# EAGLE design PCB-BI8-3x1 (EAGLE 7.1.0)

## Sheet 1 of 2
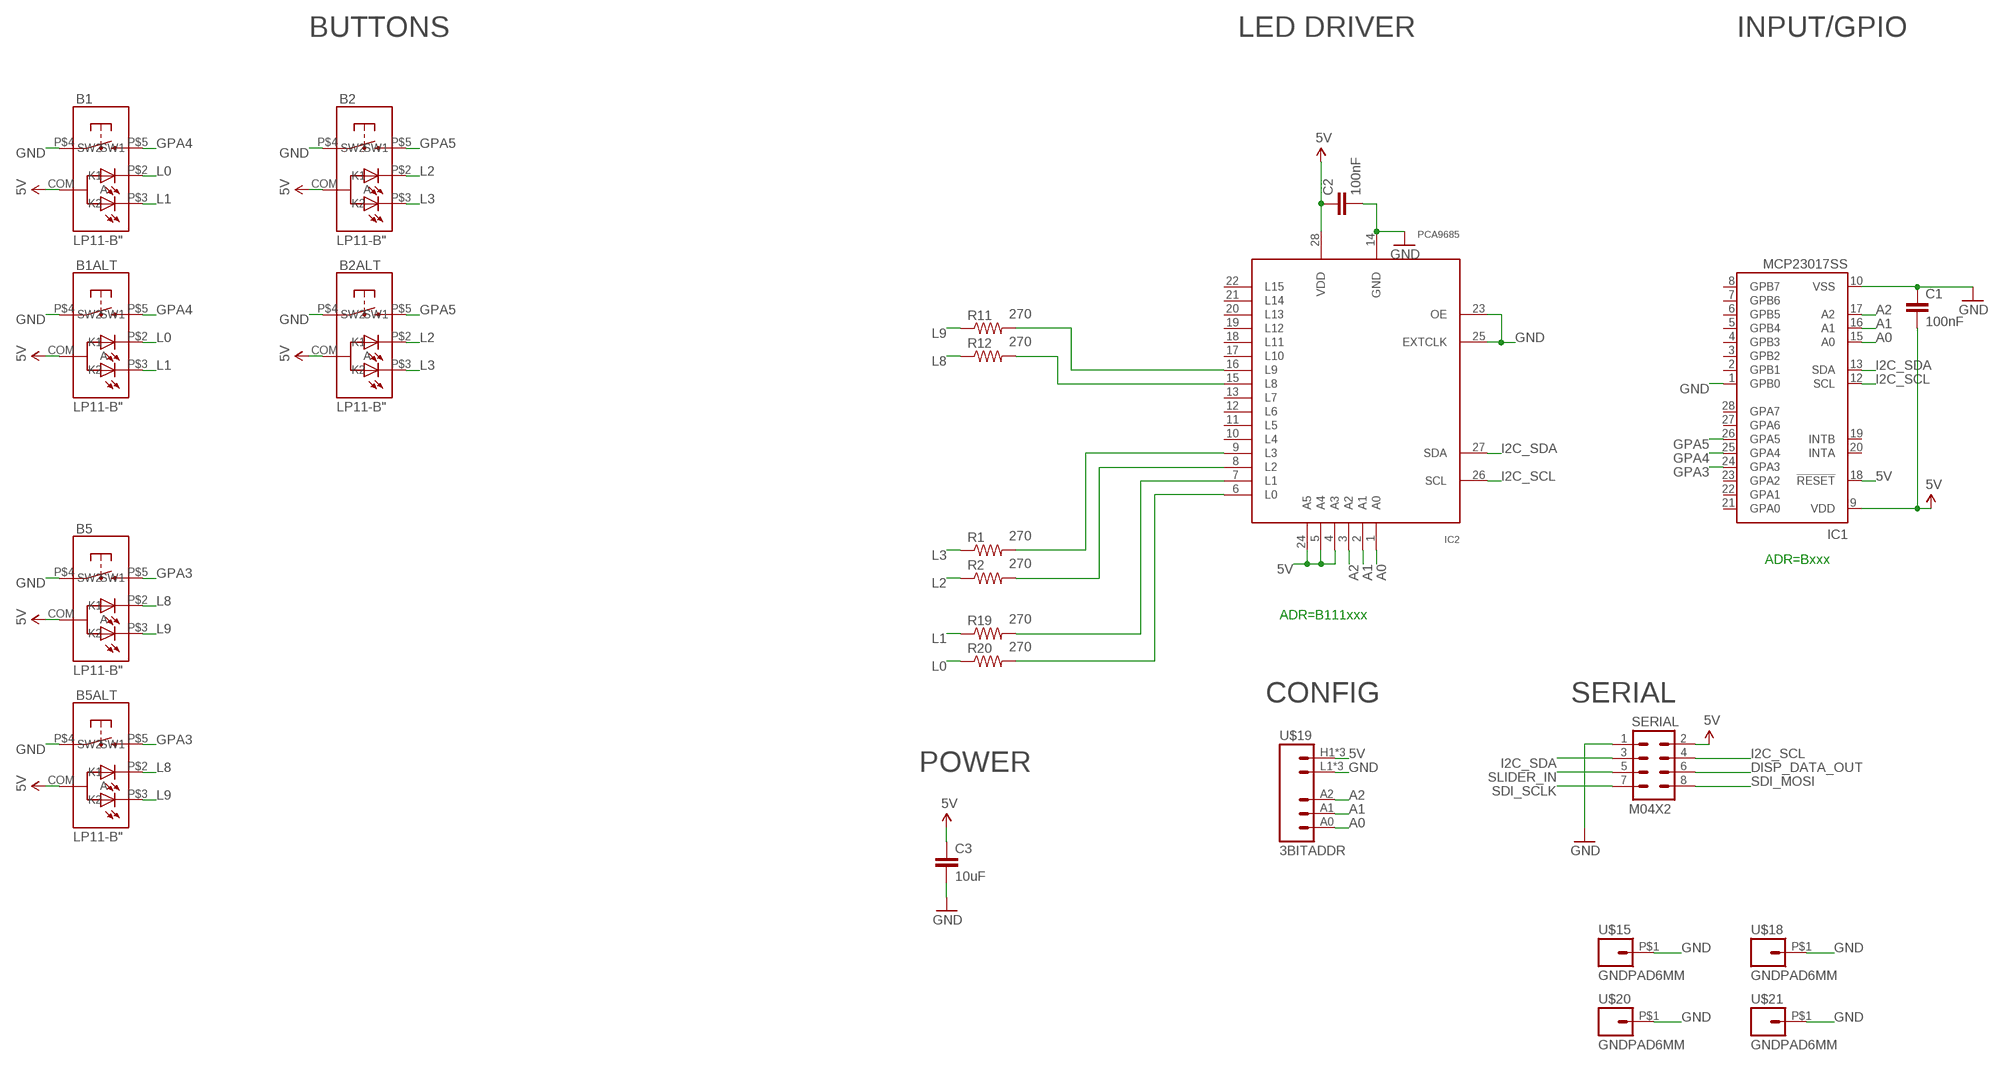
[diagram p0: schematic, sheet 1]

### Parts
B1  LP11-B"  [LP11]
B1ALT  LP11-B"  [LP11]
B2  LP11-B"  [LP11]
B2ALT  LP11-B"  [LP11]
B5  LP11-B"  [LP11]
B5ALT  LP11-B"  [LP11]
C1  100nF  CAP0603-CAP  [0603-CAP]
C2  100nF  CAP0603-CAP  [0603-CAP]
C3  10uF  CAP0805  [0805]
IC1  MCP23017SS  [SSOP28]
IC2  PCA9685  [TSSOP28]
R1  270  RESISTOR0603-RES  [0603-RES]
R2  270  RESISTOR0603-RES  [0603-RES]
R11  270  RESISTOR0603-RES  [0603-RES]
R12  270  RESISTOR0603-RES  [0603-RES]
R19  270  RESISTOR0603-RES  [0603-RES]
R20  270  RESISTOR0603-RES  [0603-RES]
SERIAL  M04X2  [2X4]
U$15  GNDPAD6MM  [3.2MMPAD6MM]
U$18  GNDPAD6MM  [3.2MMPAD6MM]
U$19  3BITADDR  [3BITADDR]
U$20  GNDPAD6MM  [3.2MMPAD6MM]
U$21  GNDPAD6MM  [3.2MMPAD6MM]

### Nets
5V [Power]: B1.COM(A) B1ALT.COM(A) B2.COM(A) B2ALT.COM(A) B5.COM(A) B5ALT.COM(A) C1.2 C2.1 C3.1 IC1.9(VDD) IC1.18(!RESET) IC2.4(A3) IC2.5(A4) IC2.24(A5) IC2.28(VDD) SERIAL.2 U$19.H1(VCC) U$19.H2(VCC) U$19.H3(VCC)
A0: IC1.15(A0) IC2.1(A0) U$19.A0
A1: IC1.16(A1) IC2.2(A1) U$19.A1
A2: IC1.17(A2) IC2.3(A2) U$19.A2
DISP_DATA_OUT: SERIAL.6
GND [Power]: B1.P$4(SW1) B1ALT.P$4(SW1) B2.P$4(SW1) B2ALT.P$4(SW1) B5.P$4(SW1) B5ALT.P$4(SW1) C1.1 C2.2 C3.2 IC1.1(GPB0) IC1.10(VSS) IC2.14(GND) IC2.23(OE) IC2.25(EXTCLK) SERIAL.1 U$15.P$1 U$18.P$1 U$19.L1(GND) U$19.L2(GND) U$19.L3(GND) U$20.P$1 U$21.P$1
GPA3: B5.P$5(SW2) B5ALT.P$5(SW2) IC1.24(GPA3)
GPA4: B1.P$5(SW2) B1ALT.P$5(SW2) IC1.25(GPA4)
GPA5: B2.P$5(SW2) B2ALT.P$5(SW2) IC1.26(GPA5)
I2C_SCL: IC1.12(SCL) IC2.26(SCL) SERIAL.4
I2C_SDA: IC1.13(SDA) IC2.27(SDA) SERIAL.3
L0: B1.P$2(K1) B1ALT.P$2(K1) R20.1
L1: B1.P$3(K2) B1ALT.P$3(K2) R19.1
L2: B2.P$2(K1) B2ALT.P$2(K1) R2.1
L3: B2.P$3(K2) B2ALT.P$3(K2) R1.1
L8: B5.P$2(K1) B5ALT.P$2(K1) R12.1
L9: B5.P$3(K2) B5ALT.P$3(K2) R11.1
N$1: IC2.8(L2) R2.2
N$2: IC2.9(L3) R1.2
N$12: IC2.7(L1) R19.2
N$19: IC2.6(L0) R20.2
N$20: IC2.15(L8) R12.2
N$21: IC2.16(L9) R11.2
SDI_MOSI: SERIAL.8
SDI_SCLK: SERIAL.7
SLIDER_IN: SERIAL.5
Unconnected: IC1.2(GPB1) IC1.3(GPB2) IC1.4(GPB3) IC1.5(GPB4) IC1.6(GPB5) IC1.7(GPB6) IC1.8(GPB7) IC1.19(INTB) IC1.20(INTA) IC1.21(GPA0) IC1.22(GPA1) IC1.23(GPA2) IC1.27(GPA6) IC1.28(GPA7) IC2.10(L4) IC2.11(L5) IC2.12(L6) IC2.13(L7) IC2.17(L10) IC2.18(L11) IC2.19(L12) IC2.20(L13) IC2.21(L14) IC2.22(L15)

### Notes on the sheet
- BUTTONS | LED DRIVER | INPUT/GPIO
- ADR=Bxxx
- ADR=B111xxx
- CONFIG | SERIAL
- POWER

## Sheet 2 of 2

## Library data of the parts
B1 B1ALT B2 B2ALT B5 B5ALT = SKAARHOJ:LP11-B
C1-C3 = SparkFun:CAP: Capacitor Standard 0603 ceramic capacitor, and 0.1" leaded capacitor.
IC1 = microchip:MCP23017: http://ww1.microchip.com/downloads/en/DeviceDoc/21952a.pdf Source: http://ww1.microchip.com/downloads/en/DeviceDoc/21952a.pdf; MF: MICROCHIP; MPN: MCP23017-E/SS; OC_FARNELL: 1467674; OC_NEWARK: 31K2960
IC2 = wsmith:PCA9685
R1 R2 R11 R12 R19 R20 = SparkFun:RESISTOR: Resistor Basic schematic elements and footprints for 0603, 1206, and PTH resistors.
SERIAL = SparkFun:M04X2
U$15 U$18 U$20 U$21 = SKAARHOJ:GNDPAD
U$19 = SKAARHOJ:3BITADDR

## Net classes
0 default: width 0.203 mm, drill 0.406 mm, clearance 0.203 mm
1 Power: width 0.406 mm, drill 0.61 mm, clearance 0.203 mm

## Board
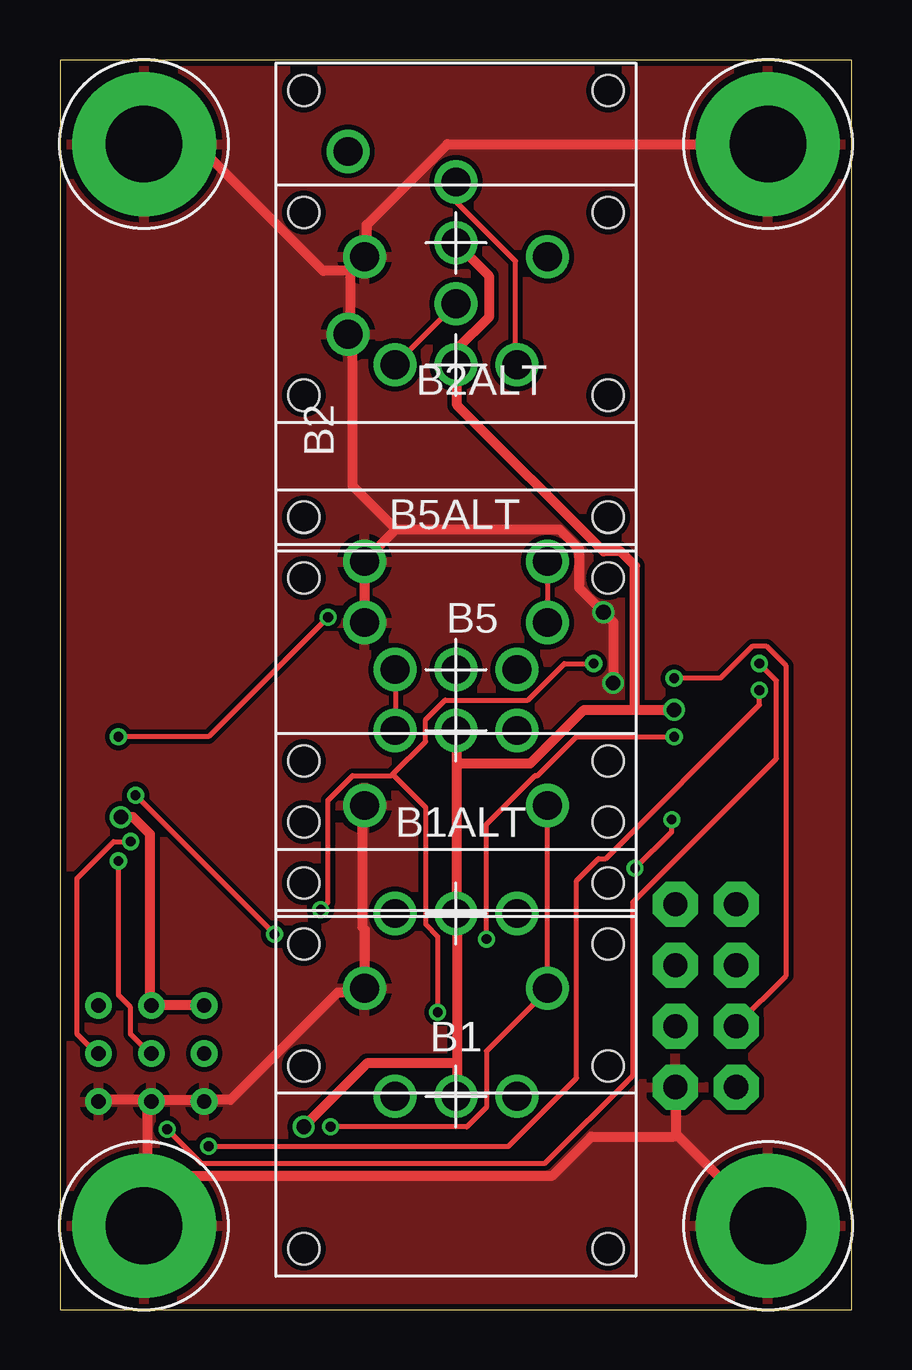
[diagram p1: board, top side]
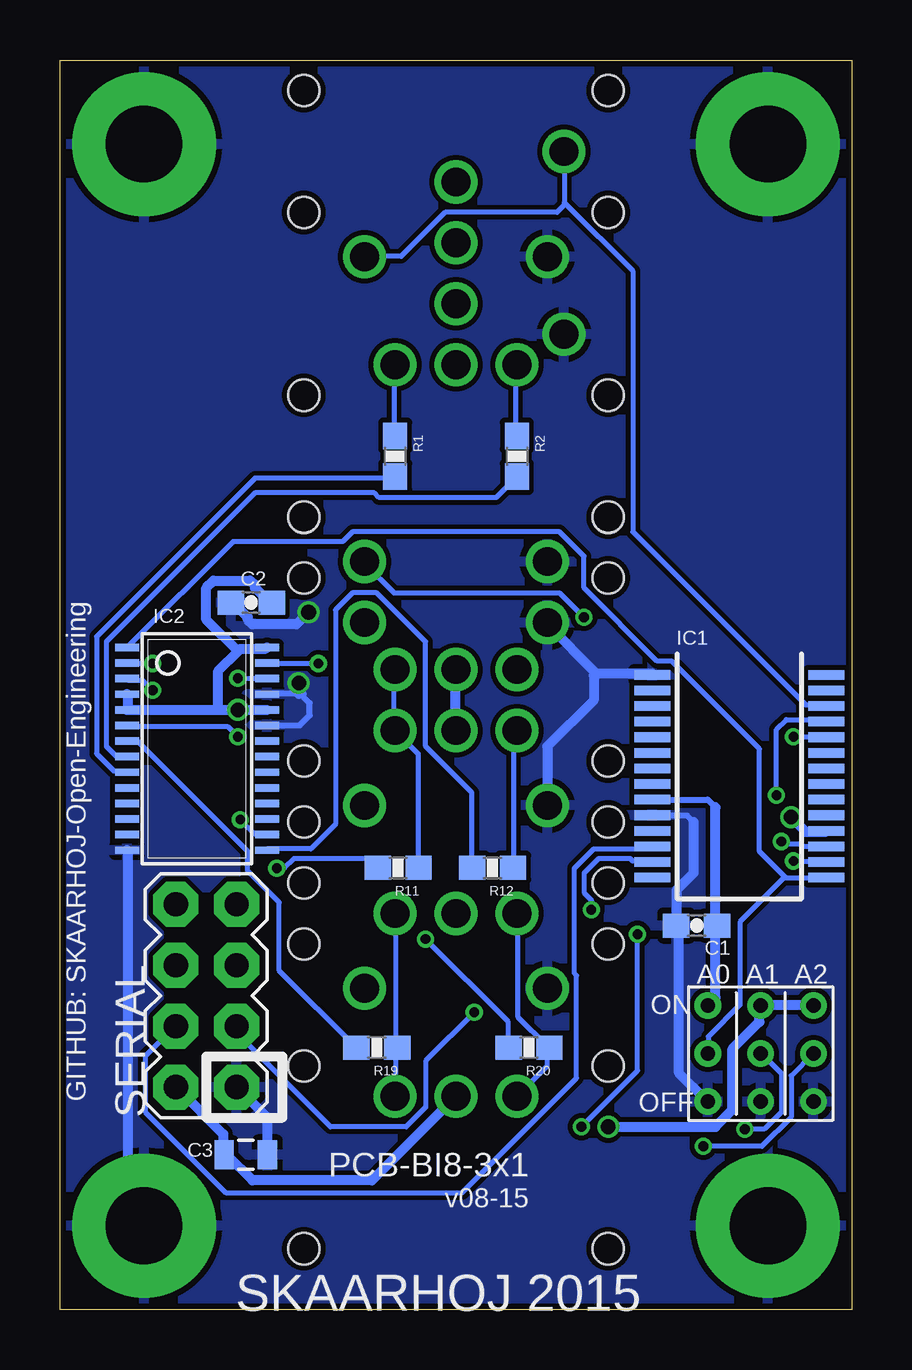
[diagram p2: board, bottom side, seen from below]

Size 33.02 x 52.07 mm. Coordinates in mm from the lower left corner, seen from the top.
Outline: 0,0 33.02,0 33.02,52.07 0,52.07 0,0
Copper layers (1*16): Top 0.035mm / dielectric 1.5mm / Bottom 0.035mm
Design rules "Fusion_eagle_rule_v1.1": minimum track width 6mil, minimum drill 12mil, track to track 6mil, track to pad 6mil, pad to pad 6mil, via to via 6mil, smd to smd 0mil, copper to edge 10mil, drill to drill 10mil, minimum pad ring 10mil, minimum via ring 6mil, stop-mask expansion 2mil, vias tented up to drill 100mil, thermal gap 10mil

### Footprints (pad centres in the part's own frame; a part is rotated, then mirrored left to right if it is on the bottom)
LP11 = drill 1.2: COM 0,0; P$2 0,2.54; P$3 0,-2.54; P$4 4.5,3.81; P$5 4.5,-3.81 | hole 1.3: -6.35,6.35; 6.35,6.35; 6.35,-6.35; -6.35,-6.35
0603-CAP = smd 1.1 x 1: 1 -0.85,0; 2 0.85,0
0805 = smd 0.8 x 1.2: 1 -0.9,0; 2 0.9,0
SSOP28 = smd 0.4 x 1.5: 1 -4.225,-3.625; 2 -3.575,-3.625; 3 -2.925,-3.625; 4 -2.275,-3.625; 5 -1.625,-3.625; 6 -0.975,-3.625; 7 -0.325,-3.625; 8 0.325,-3.625; 9 0.975,-3.625; 10 1.625,-3.625; 11 2.275,-3.625; 12 2.925,-3.625; 13 3.575,-3.625; 14 4.225,-3.625; 15 4.225,3.625; 16 3.575,3.625; 17 2.925,3.625; 18 2.275,3.625; 19 1.625,3.625; 20 0.975,3.625; 21 0.325,3.625; 22 -0.325,3.625; 23 -0.975,3.625; 24 -1.625,3.625; 25 -2.275,3.625; 26 -2.925,3.625; 27 -3.575,3.625; 28 -4.225,3.625
TSSOP28 = smd 0.305 x 0.991: 1 -4.225,-2.918; 2 -3.575,-2.918; 3 -2.925,-2.918; 4 -2.275,-2.918; 5 -1.625,-2.918; 6 -0.975,-2.918; 7 -0.325,-2.918; 8 0.325,-2.918; 9 0.975,-2.918; 10 1.625,-2.918; 11 2.275,-2.918; 12 2.925,-2.918; 13 3.575,-2.918; 14 4.225,-2.918; 15 4.225,2.918; 16 3.575,2.918; 17 2.925,2.918; 18 2.275,2.918; 19 1.625,2.918; 20 0.975,2.918; 21 0.325,2.918; 22 -0.325,2.918; 23 -0.975,2.918; 24 -1.625,2.918; 25 -2.275,2.918; 26 -2.925,2.918; 27 -3.575,2.918; 28 -4.225,2.918
0603-RES = smd 1.1 x 1: 1 -0.85,0; 2 0.85,0
2X4 = drill 1.016 pad 1.88 octagon: 1 -3.81,-1.27; 2 -3.81,1.27; 3 -1.27,-1.27; 4 -1.27,1.27; 5 1.27,-1.27; 6 1.27,1.27; 7 3.81,-1.27; 8 3.81,1.27
3.2MMPAD6MM = drill 3.2 pad 6: P$1 0,0
3BITADDR = drill 0.6: A0 -2.2,0; A1 0,0; A2 2.2,0; H1 -2.2,2; H2 0,2; H3 2.2,2; L1 -2.2,-2; L2 0,-2; L3 2.2,-2

### Placement (x,y rotation side)
B1  16.51,8.89 90 top
B1ALT  16.51,16.51 90 top
B2  16.51,39.37 90 top
B2ALT  16.51,44.45 180 top
B5  16.51,24.13 90 top
B5ALT  16.51,26.67 90 top
C1  6.48,16 0 bottom
C2  25.04,29.46 180 bottom
C3  25.27,6.45 0 bottom
IC1  4.7,22.23 270 bottom
IC2  27.3,23.37 270 bottom
R1  19.05,35.56 270 bottom
R2  13.97,35.56 270 bottom
R11  18.92,18.41 180 bottom
R12  14.99,18.41 180 bottom
R19  19.81,10.92 180 bottom
R20  13.46,10.92 180 bottom
SERIAL  26.92,13.08 90 bottom
U$15  3.5,3.5 0 top
U$18  29.52,3.5 0 top
U$19  3.81,10.67 0 bottom
U$20  3.5,48.57 0 top
U$21  29.52,48.57 0 top

### Tracks (layer width: path | path; a pad name or v marks a point on that pad's centre or on a via)
5V  (via drill 0.61)
  Top 0.406: v2.54,20.52 3.05,20.52 3.76,19.81 3.76,12.7 U$19.H2 3.96,12.7 5.99,12.7 U$19.H1 | B2ALT.COM 17.88,43.08 17.88,41.35 16.56,40.03 16.56,39.42 B2.COM 16.56,39.22 16.56,37.69 22.66,31.6 23.37,31.6 23.98,30.99 23.98,24.99 | 16.56,10.26 16.56,16.46 B1ALT.COM 16.56,16.66 16.56,22.76 | 16.56,10.26 16.56,8.94 B1.COM | 16.56,22.76 16.56,24.08 B5.COM | 23.98,24.99 21.84,24.99 19.61,22.76 16.56,22.76 | 23.98,24.99 v25.6,24.99 | v10.16,7.62 12.8,10.26 16.56,10.26
  Bottom 0.254: IC1.9 6.01,21.25 5.71,20.95
  Bottom 0.406: U$19.H1 5.99,12.7 5.69,13.01 5.69,15.95 C1.2 5.69,16.15 5.69,20.93 5.71,20.95 | v2.54,20.52 1.93,19.91 1.12,19.91 IC1.18 | U$19.H3 1.63,12.7 3.76,12.7 U$19.H2 3.86,12.5 3.86,11.99 4.98,10.87 4.98,8.33 5.69,7.62 v10.16,7.62 | 30.18,24.99 26.42,24.99 | 26.42,24.99 v25.6,24.99 24.49,24.99 IC2.24 | 30.18,24.99 IC2.5 | 25.6,27.43 26.42,26.62 26.42,24.99 | 25.6,27.43 25.5,27.53 24.49,27.53 IC2.28 | 30.18,24.99 30.18,25.6 IC2.4 | 25.6,27.43 26.92,28.75 26.92,30.07 26.62,30.38 25.09,30.38 24.89,30.18 24.89,30.07 24.28,29.46 C2.1 | B5.COM 16.56,24.18 16.56,26.62 B5ALT.COM | SERIAL.2 28.14,9.25 26.21,7.32 26.21,6.5 C3.1 26.01,6.4 24.99,5.38 20.02,5.38 B1.COM
A0
  Bottom 0.203: 2.79,18.03 2.74,17.98 1.12,17.98 IC1.15 | 2.79,18.03 3.86,19.1 3.86,23.37 7.52,27.03 8.13,27.03 11.18,30.07 11.18,31.39 12.19,32.41 20.83,32.41 21.23,32 25.81,32 30.18,27.64 IC2.1 | 2.79,18.03 4.67,16.15 4.67,12.7 5.99,11.38 5.99,10.67 U$19.A0
A1  (via drill 0.41)
  Top 0.203: v29.16,26.92 29.87,26.21 29.87,22.96 23.88,16.97 23.88,9.75 20.22,6.1 5.89,6.1 v4.47,7.52 | v2.44,18.69 2.44,13.11 2.95,12.6 2.95,11.48 3.76,10.67 U$19.A1
  Bottom 0.203: v29.16,26.92 30.18,26.92 IC2.2 | v4.47,7.52 3.66,7.52 2.95,8.23 2.95,9.86 3.76,10.67 U$19.A1 | v2.44,18.69 1.12,18.69 IC1.16
A2  (via drill 0.41)
  Top 0.203: v29.16,25.81 29.16,25.2 22.76,18.8 22.45,18.8 21.54,17.88 21.54,9.65 18.69,6.81 v6.2,6.81 | v2.95,19.51 2.23,19.51 0.71,17.98 0.71,11.48 1.52,10.67 U$19.A2
  Bottom 0.203: v29.16,25.81 29.57,26.21 30.18,26.21 IC2.3 | v6.2,6.81 3.76,6.81 2.54,8.03 2.54,9.75 1.63,10.67 U$19.A2 | v2.95,19.51 2.85,19.41 2.13,19.41 2.03,19.3 1.12,19.3 IC1.17
GND  (via drill 0.61)
  Top 0.406: 25.7,7.32 25.7,9.25 SERIAL.1 | U$18.P$1 25.7,7.32 | U$19.L3 1.63,8.74 3.76,8.74 U$19.L2 | U$19.L2 3.96,8.74 5.99,8.74 U$19.L1 6.2,8.74 7.11,8.74 11.58,13.21 12.6,13.21 B1.P$4 12.7,15.85 12.6,15.95 12.6,20.83 12.7,20.93 B1ALT.P$4 | U$19.L2 3.66,8.53 3.66,3.66 U$15.P$1 3.76,5.59 20.52,5.59 22.15,7.21 25.6,7.21 25.7,7.32 | 12.09,43.18 12.09,40.64 B2ALT.P$4 12.19,40.54 12.19,34.34 14.02,32.51 | 12.09,43.18 12.7,43.79 B2.P$4 12.8,43.99 12.8,45.21 16.15,48.56 29.46,48.56 U$21.P$1 | 14.02,32.51 20.83,32.51 21.64,31.7 21.64,30.07 v22.66,29.06 23.06,28.65 v23.06,26.11 | 14.02,32.51 12.7,31.19 B5ALT.P$4 B5.P$4 | U$20.P$1 3.56,48.56 5.69,48.56 10.97,43.28 11.99,43.28 12.09,43.18
  Bottom 0.254: IC1.10 6.88,20.6 6.6,20.32 | IC2.23 23.03,24.34 22.61,24.77 22.61,25.27 22.86,25.53 22.86,25.65 23.06,25.65 24.38,25.65 IC2.25
  Bottom 0.406: C3.2 24.38,6.5 24.38,8.03 25.6,9.25 SERIAL.1 | IC2.14 30.18,19.1 30.18,4.17 29.57,3.56 U$18.P$1 | 6.6,20.32 6.6,18.19 7.32,17.48 7.32,16.05 C1.1 7.21,15.85 7.21,9.86 6.1,8.74 U$19.L1 | 10.67,26.52 8.33,26.52 IC1.1 | 10.67,26.52 12.7,28.55 B5.P$4 | v22.66,29.06 23.16,28.55 24.99,28.55 25.2,28.75 25.2,28.85 25.81,29.46 C2.2 | v23.06,26.11 23.06,25.65 | B1ALT.P$4 12.7,23.47 10.77,25.4 10.77,26.42 10.67,26.52
  pour Top: 0,0 33.02,0 33.02,52.07 0,52.07
  pour Bottom: 0,0 33.02,0 33.02,52.07 0,52.07
GPA3  (via drill 0.41)
  Top 0.203: v2.44,23.88 6.2,23.88 v11.18,28.85 | B5ALT.P$5 B5.P$5
  Bottom 0.203: v2.44,23.88 1.12,23.88 IC1.24 | v11.18,28.85 12.19,29.87 19.1,29.87 20.32,31.09 B5ALT.P$5
GPA4  (via drill 0.41)
  Top 0.203: v8.94,15.65 v3.15,21.44 | v11.28,7.62 16.97,7.62 17.78,8.43 17.78,10.77 20.32,13.31 B1.P$5 B1ALT.P$5
  Bottom 0.203: v3.15,21.44 3.15,24.18 2.74,24.59 1.12,24.59 IC1.25 | v8.94,15.65 8.94,9.96 v11.28,7.62
GPA5
  Bottom 0.203: 11.94,46.08 11.99,46.13 11.99,48.26 B2ALT.P$5 | 11.94,46.08 9.14,43.28 9.14,32.41 1.93,25.2 1.12,25.2 IC1.26 | 11.94,46.08 12.29,45.72 16.97,45.72 18.8,43.89 20.32,43.89 B2.P$5
I2C_SCL  (via drill 0.41)
  Top 0.203: v25.6,26.31 27.53,26.31 28.85,27.64 29.46,27.64 30.28,26.82 30.28,13.92 28.25,11.89 SERIAL.4
  Bottom 0.203: v25.6,26.31 24.49,26.31 IC2.26 | IC1.12 8.33,19.2 10.77,19.2 11.58,18.39 11.58,14.02 11.48,13.92 11.48,9.65 16.26,4.88 26.11,4.88 29.46,8.23 29.46,10.57 28.25,11.79 SERIAL.4
I2C_SDA  (via drill 0.41)
  Top 0.203: v22.25,26.92 21.03,26.92 19.51,25.4 16.05,25.4 15.24,24.59 15.24,23.67 13.87,22.3 | 13.87,22.3 13.82,22.25 12.19,22.25 11.18,21.23 11.18,16.97 v10.87,16.66 | v15.75,12.39 15.75,15.54 15.24,16.05 15.24,20.93 13.87,22.3
  Bottom 0.203: v22.25,26.92 24.38,26.92 IC2.27 | v10.87,16.66 10.87,17.07 11.18,17.37 11.18,18.19 10.57,18.8 9.25,18.8 9.14,18.69 8.33,18.69 IC1.13 | v15.75,12.39 17.78,10.36 17.78,8.43 18.59,7.62 21.74,7.62 25.6,11.48 25.6,11.79 SERIAL.3
L0
  Bottom 0.203: B1.P$2 12.7,10.16 12.7,10.87 R20.1 12.7,10.97 13.92,12.19 13.92,16.46 B1ALT.P$2
L1
  Bottom 0.203: B1.P$3 19,8.94 19,10.87 R19.1 19,10.97 19,16.46 B1ALT.P$3
L2
  Top 0.203: B2.P$2 B2ALT.P$2
  Bottom 0.203: R2.1 14.02,36.47 14.02,39.32 B2.P$2
L3
  Top 0.203: B2ALT.P$3 16.56,46.94 16.56,46.13 19,43.69 19,39.42 B2.P$3
  Bottom 0.203: R1.1 19.1,36.47 19.1,39.32 B2.P$3
L8
  Top 0.203: B5ALT.P$2 14.02,26.62 14.02,24.18 B5.P$2
  Bottom 0.203: B5.P$2 14.12,23.98 14.12,18.49 R12.1
L9
  Bottom 0.203: R11.1 18.09,18.49 18.09,23.16 B5.P$3 19.1,24.18 19.1,26.62 B5ALT.P$3
N$1
  Bottom 0.203: IC2.8 30.28,23.06 30.68,23.06 31.09,23.47 31.09,27.84 24.89,34.04 19.91,34.04 19.71,33.83 14.83,33.83 14.02,34.65 R2.2
N$2
  Bottom 0.203: IC2.9 30.28,22.45 30.79,22.45 31.5,23.16 31.5,28.04 24.89,34.65 19.1,34.65 R1.2
N$12
  Bottom 0.203: IC2.7 30.18,23.67 29.77,23.67 25.2,19.1 25.2,18.29 23.88,16.97 23.88,14.12 20.73,10.97 R19.2
N$19  (via drill 0.41)
  Top 0.203: v25.6,23.88 21.54,23.88 19.91,22.25 19.81,22.25 17.78,20.22 v17.78,15.44
  Bottom 0.203: v25.6,23.88 26.01,24.28 30.18,24.28 IC2.6 | v17.78,15.44 14.33,11.99 14.33,10.97 R20.2
N$20
  Bottom 0.203: IC2.15 24.38,19.2 22.55,19.2 21.54,20.22 21.54,29.16 20.83,29.87 19.81,29.87 17.78,27.84 17.78,23.47 15.85,21.54 15.85,18.49 R12.2
N$21  (via drill 0.41)
  Top 0.203: v25.5,20.42 25.5,19.91 v23.98,18.39
  Bottom 0.203: v25.5,20.42 24.89,19.81 24.49,19.81 IC2.16 | v23.98,18.39 23.67,18.39 23.27,18.8 20.12,18.8 19.81,18.49 R11.2

### Text on the board
_bsilk: GITHUB: SKAARHOJ-Open-Engineering | PCB-BI8-3x1 | v08-15 | SKAARHOJ 2015